# EAGLE design ab-berry-rev2 (EAGLE 7.3.0)
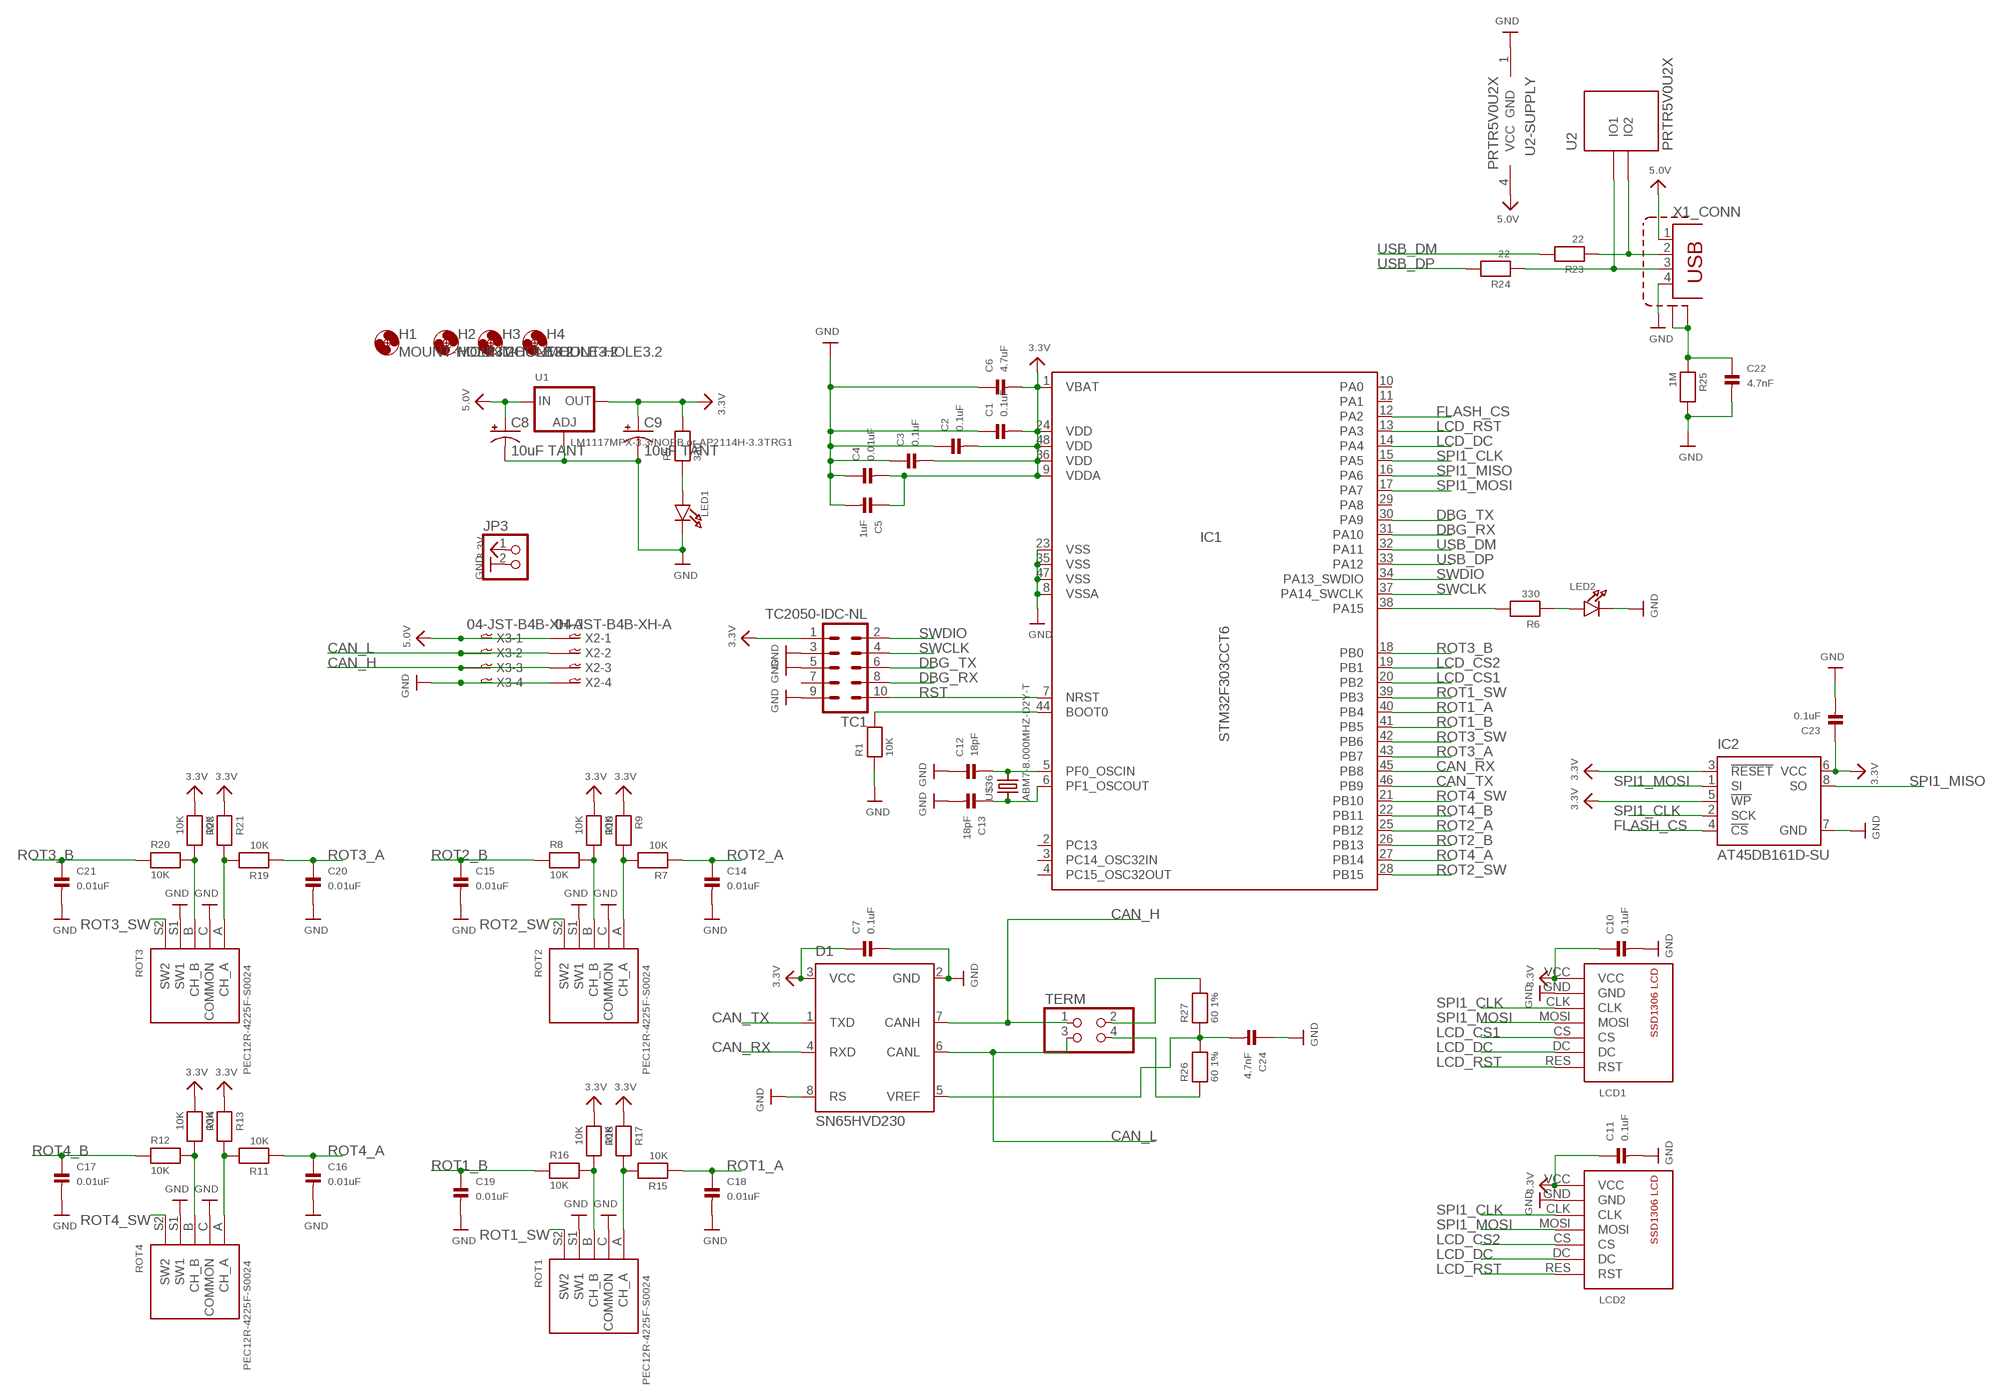
[diagram p0: schematic, sheet 1]

## Parts
C1  0.1uF  CAP_CERAMIC0603  [0603]
C2  0.1uF  CAP_CERAMIC0603  [0603]
C3  0.1uF  CAP_CERAMIC0603  [0603]
C4  0.01uF  CAP_CERAMIC0603  [0603]
C5  1uF  CAP_CERAMIC0603  [0603]
C6  4.7uF  CAP_CERAMIC0603  [0603]
C7  0.1uF  CAP_CERAMIC0603  [0603]
C8  10uF TANT  10UF-6.3V-20%(0603)(TANT)"  [0603-POL]
C9  10uF TANT  10UF-6.3V-20%(0603)(TANT)"  [0603-POL]
C10  0.1uF  CAP_CERAMIC0603  [0603]
C11  0.1uF  CAP_CERAMIC0603  [0603]
C12  18pF  CAP_CERAMIC0603  [0603]
C13  18pF  CAP_CERAMIC0603  [0603]
C14  0.01uF  CAP_CERAMIC0603  [0603]
C15  0.01uF  CAP_CERAMIC0603  [0603]
C16  0.01uF  CAP_CERAMIC0603  [0603]
C17  0.01uF  CAP_CERAMIC0603  [0603]
C18  0.01uF  CAP_CERAMIC0603  [0603]
C19  0.01uF  CAP_CERAMIC0603  [0603]
C20  0.01uF  CAP_CERAMIC0603  [0603]
C21  0.01uF  CAP_CERAMIC0603  [0603]
C22  4.7nF  CAP_CERAMIC0603  [0603]
C23  0.1uF  CAP_CERAMIC0603  [0603]
C24  4.7nF  CAP_CERAMIC0603  [0603]
D1  SN65HVD230  [SO8]
H1  MOUNT-HOLE3.2  [3,2]
H2  MOUNT-HOLE3.2  [3,2]
H3  MOUNT-HOLE3.2  [3,2]
H4  MOUNT-HOLE3.2  [3,2]
IC1  STM32F303CCT6  STM32F302_F303_B_C_LQFP48  [TQFP48]
IC2  AT45DB161D-SU  [8S2]
JP3  PINHD-1X2  [1X02]
LCD1  SSD1306-7PINWITHOUT-HOLES  [SSD1306-7PIN-NO-HOLES]
LCD2  SSD1306-7PINWITHOUT-HOLES  [SSD1306-7PIN-NO-HOLES]
LED1  LED0603  [CHIPLED_0603]
LED2  LED0603  [CHIPLED_0603]
R1  10K  RESISTOR0603  [0603]
R5  330  RESISTOR0603  [0603]
R6  330  RESISTOR0603  [0603]
R7  10K  RESISTOR0603  [0603]
R8  10K  RESISTOR0603  [0603]
R9  10K  RESISTOR0603  [0603]
R10  10K  RESISTOR0603  [0603]
R11  10K  RESISTOR0603  [0603]
R12  10K  RESISTOR0603  [0603]
R13  10K  RESISTOR0603  [0603]
R14  10K  RESISTOR0603  [0603]
R15  10K  RESISTOR0603  [0603]
R16  10K  RESISTOR0603  [0603]
R17  10K  RESISTOR0603  [0603]
R18  10K  RESISTOR0603  [0603]
R19  10K  RESISTOR0603  [0603]
R20  10K  RESISTOR0603  [0603]
R21  10K  RESISTOR0603  [0603]
R22  10K  RESISTOR0603  [0603]
R23  22  RESISTOR0603  [0603]
R24  22  RESISTOR0603  [0603]
R25  1M  RESISTOR0603  [0603]
R26  60 1%  RESISTOR0603  [0603]
R27  60 1%  RESISTOR0603  [0603]
ROT1  PEC12R-4225F-S0024  PEC11-4215K-S0024  [PEC111-4XXXK-SXXXX]
ROT2  PEC12R-4225F-S0024  PEC11-4215K-S0024  [PEC111-4XXXK-SXXXX]
ROT3  PEC12R-4225F-S0024  PEC11-4215K-S0024  [PEC111-4XXXK-SXXXX]
ROT4  PEC12R-4225F-S0024  PEC11-4215K-S0024  [PEC111-4XXXK-SXXXX]
TC1  TC2050-IDC-NL  [TC2050-IDC-NL]
TERM  PINHD-2X2  [2X02]
U1  LM1117MPX-3.3/NOPB or AP2114H-3.3TRG1  LM1117SOT223-REFLOW  [SOT223-R]
U2  PRTR5V0U2X  [SOT-143B]
U$36  ABM7-8.000MHZ-D2Y-T  [ABM7-8.000MHZ-D2Y-T]
X1  TE-292304-1  [TE-292304-1]
X2  04-JST-B4B-XH-A  [B4B-XH]
X3  04-JST-B4B-XH-A  [B4B-XH]

## Nets
3.3V: C1.2 C2.2 C3.2 C4.2 C5.1 C6.2 C7.1 C9.A(+) C10.1 C11.1 C23.1 D1.3(VCC) IC1.1(VBAT) IC1.9(VDDA) IC1.24(VDD) IC1.36(VDD) IC1.48(VDD) IC2.3(!RESET) IC2.5(!WP) IC2.6(VCC) JP3.1 LCD1.VCC LCD2.VCC R5.2 R9.1 R10.1 R13.1 R14.1 R17.1 R18.1 R21.1 R22.1 TC1.1 U1.2(OUT)
5.0V: C8.A(+) U1.3(IN) U2.4(VCC) X1.1 X2.P$1 X3.P$1
CAN_H: D1.7(CANH) TERM.1 X2.P$3 X3.P$3
CAN_L: D1.6(CANL) TERM.3 X2.P$2 X3.P$2
CAN_RX: D1.4(RXD) IC1.45(PB8)
CAN_TX: D1.1(TXD) IC1.46(PB9)
DBG_RX: IC1.31(PA10) TC1.8
DBG_TX: IC1.30(PA9) TC1.6
FLASH_CS: IC1.12(PA2) IC2.4(!CS)
GND: C1.1 C2.1 C3.1 C4.1 C5.2 C6.1 C7.2 C8.K(-) C9.K(-) C10.2 C11.2 C12.1 C13.2 C14.2 C15.2 C16.2 C17.2 C18.2 C19.2 C20.2 C21.2 C22.2 C23.2 C24.1 D1.2(GND) D1.8(RS) IC1.8(VSSA) IC1.23(VSS) IC1.35(VSS) IC1.47(VSS) IC2.7(GND) JP3.2 LCD1.GND LCD2.GND LED1.C LED2.C R1.1 R25.2 ROT1.C(COMMON) ROT1.S1(SW1) ROT2.C(COMMON) ROT2.S1(SW1) ROT3.C(COMMON) ROT3.S1(SW1) ROT4.C(COMMON) ROT4.S1(SW1) TC1.3 TC1.5 TC1.9 U1.1(ADJ) U2.1(GND) X1.4 X2.P$4 X3.P$4
LCD_CS1: IC1.20(PB2) LCD1.CS
LCD_CS2: IC1.19(PB1) LCD2.CS
LCD_DC: IC1.14(PA4) LCD1.DC LCD2.DC
LCD_RST: IC1.13(PA3) LCD1.RES(RST) LCD2.RES(RST)
N$1: IC1.44(BOOT0) R1.2
N$2: C24.2 D1.5(VREF) R26.2 R27.1
N$3: LED1.A R5.1
N$4: R27.2 TERM.2
N$5: R26.1 TERM.4
N$6: IC1.38(PA15) R6.2
N$7: LED2.A R6.1
N$8: C12.2 IC1.5(PF0_OSCIN) U$36.P$2
N$9: C13.1 IC1.6(PF1_OSCOUT) U$36.P$1
N$10: R8.2 R10.2 ROT2.B(CH_B)
N$11: R7.2 R9.2 ROT2.A(CH_A)
N$12: R12.2 R14.2 ROT4.B(CH_B)
N$13: R11.2 R13.2 ROT4.A(CH_A)
N$14: R16.2 R18.2 ROT1.B(CH_B)
N$15: R15.2 R17.2 ROT1.A(CH_A)
N$16: R20.2 R22.2 ROT3.B(CH_B)
N$17: R19.2 R21.2 ROT3.A(CH_A)
N$18: R23.1 U2.3(IO2) X1.2
N$19: R24.1 U2.2(IO1) X1.3
N$20: C22.1 R25.1 X1.P$1(SHIELD:S1) X1.P$2(SHIELD:S2)
ROT1_A: C18.1 IC1.40(PB4) R15.1
ROT1_B: C19.1 IC1.41(PB5) R16.1
ROT1_SW: IC1.39(PB3) ROT1.S2(SW2)
ROT2_A: C14.1 IC1.25(PB12) R7.1
ROT2_B: C15.1 IC1.26(PB13) R8.1
ROT2_SW: IC1.28(PB15) ROT2.S2(SW2)
ROT3_A: C20.1 IC1.43(PB7) R19.1
ROT3_B: C21.1 IC1.18(PB0) R20.1
ROT3_SW: IC1.42(PB6) ROT3.S2(SW2)
ROT4_A: C16.1 IC1.27(PB14) R11.1
ROT4_B: C17.1 IC1.22(PB11) R12.1
ROT4_SW: IC1.21(PB10) ROT4.S2(SW2)
RST: IC1.7(NRST) TC1.10
SPI1_CLK: IC1.15(PA5) IC2.2(SCK) LCD1.CLK LCD2.CLK
SPI1_MISO: IC1.16(PA6) IC2.8(SO)
SPI1_MOSI: IC1.17(PA7) IC2.1(SI) LCD1.MOSI LCD2.MOSI
SWCLK: IC1.37(PA14_SWCLK) TC1.4
SWDIO: IC1.34(PA13_SWDIO) TC1.2
USB_DM: IC1.32(PA11) R23.2
USB_DP: IC1.33(PA12) R24.2
Unconnected: IC1.2(PC13) IC1.3(PC14_OSC32IN) IC1.4(PC15_OSC32OUT) IC1.10(PA0) IC1.11(PA1) IC1.29(PA8) TC1.7

## Library data of the parts
C1-C7 C10-C24 = microbuilder:CAP_CERAMIC: Ceramic Capacitors 0402 - 0402 Surface Mount Capacitors 16pF 50V 5% [Digikey: 445-4899-2-ND] 18pF 50V 5% [Digikey: 490-1281-2-ND] 22pF 50V 5% [Digikey: 490-1283-2-ND] 68pF 50V 5% [Digikey: 490-1289-2-ND] 0.1uF 10V 10% [Digikey: 490-1318-2-ND] 1.0uF 6.3V 10% [Digikey: 490-1320-2-ND] 0603 - 0603 Surface Mount Capacitors 16 pF 50V 5% [Digikey: 445-5051-2-ND] 22 pF 50V [Digikey: PCC220ACVTR-ND] 33 pF 50V 5% [Digikey: 490-1415-1-ND] 56pF 50V 5% [Digikey: 490-1421-1-ND] 220pF 50V 5% [Digikey: 445-1285-1-ND] 680 pF 50V 2200 pF 50V 5% C0G [Digikey: 445-1297-1-ND] 5600 pF 100V 5% X7R [Digikey: 478-3711-1-ND] 0.1 µF 25V 10% [Digikey: PCC2277TR-ND] 0.22 µF 16V 10% X7R [Digikey: 445-1318-1-ND] 1.0 µF 25V 10% [Digikey: 445-5146-2-ND] 0603 - RF Specific 3pF 250V +/-0.1pF RF [Digikey: 712-1347-1-ND] 18 pF 250V 5% [Digikey: 478-3505-1-ND or 712-1322-1-ND] 56 pF 250V 5% C0G RF [Digikey: 490-4867-1-ND] 68 pF 250V RF [Digikey: 490-4868-1-ND] 0805 - 0805 Surface Mount Capacitors 220 pF 250V 2% RF Ceramic Capacitor [Digikey: 712-1398-1-ND] 1000 pF 50V 2% NP0 Ceramic Capacitor [Digikey: 478-3760-1-ND] 0.1 µF 25V 10% Ceramic Capacitor [Digikey: PCC1828TR-ND] 1.0 µF 16V 10% Ceramic Capacitor[Digikey: 490-1691-2-ND] 10.0 µF 10V 10% Ceramic Capacitor[Digikey: 709-1228-1-ND] 10.0 uF 16V 10% Ceramic Capacitor [Digikey: 478-5165-2-ND] 47 uF 6.3V 20% Ceramic Capacitor [Digikey: 587-1779-1-ND or 399-5506-1-ND] 1206 - 1206 Surface Mount Capacitors 47uF 10V 20% Ceramic Capacitor [Digikey: 490-5528-1-ND or 399-5508-1-ND or 445-6010-1-ND] 100uF 6.3V -20%, +80% Y5V Ceramic Capacitor (Digikey: 490-4512-1-ND, Mouser: 81-GRM31CF50J107ZE1L)
C8 C9 = SparkFun-Capacitors:10UF-6.3V-20%(0603)(TANT); PROD_ID: CAP-13210; VALUE: 10uF
D1 = omc:SN65HVD230: SN65HVD230 - 3.3V CAN Transceiver - 3.3V operation - ISO 11898 compliant - up to 1Mbps - up to 120 nodes - listen only mode - slope control
H1-H4 = holes:MOUNT-HOLE: MOUNTING HOLE with drill center marker
IC1 = keves:STM32F302_F303_B_C_LQFP48: STM32F302_F303_B_C_LQFP48 edit this description Auto generated by make-symbol-device-package-bsdl.ulp Rev. 44 Source: STM32F302_F303_B_C_LQFP48.bsd
IC2 = atmel:AT45DB161D: 16-megabit 2.5V or 2.7V DataFlash Source: http://www.atmel.com/dyn/resources/prod_documents/doc3500.pdf; MF: ATMEL; MPN: AT45DB161D-SU; OC_FARNELL: 1455040
JP3 = pinhead:PINHD-1X2: PIN HEADER
LCD1 LCD2 = keves:SSD1306-7PIN: https://www.aliexpress.com/item/free-shipping-0-96-inch-OLED-display-module-128X64-OLED-For-arduino-I2C-IIC-SPI-7p/32595065668.html?ws_ab_test=searchweb0_0,searchweb201602_1_116_117_10065_10068_114_10067_115_10069_113_10017_10080_10082_10081_10060_10061_10062_10056_10055_10054_10059_10078_10079_10073_10070_10052_10053_10050_10051,searchweb201603_6&btsid=51ed1bae-6cee-4f36-9ddd-1a85c2e0ff68
LED1 LED2 = microbuilder:LED: LED 0603 - 0603 Surface Mount Package 2mA: Green LED - Low Power (3.9mcd, 2ma, 1.7Vf) - Digikey: 475-2709-2-ND Orange LED - Low Power (9.8mcd, 2ma, 1.8Vf) - Digikey: 475-1194-2-ND Red LED - Low Power (5mcd, 2ma, 1.8Vf) - Digikey: 475-1195-2-ND Yellow LED - Low Power (7mcd, 2ma, 1.8Vf) - Digikey: 475-1196-2-ND 5mA: Blue LED - Low Power (17mcd, 5ma, 2.9Vf) - Digikey: LNJ937W8CRACT-ND 0805 - 0805 Surface Mount Package 2mA: Red LED (8.8mcd, 2mA, 1.8Vf, Clear) - Low Power [Digikey: 475-2510-1-ND] Green LED (5mcd, 2mA, 1.8Vf, Clear) - Low Power [Digikey: 475-2730-1-ND] Yellow LED (11.3mcd, 2mA, 1.8Vf, Clear) - Low Power [Digikey: 475-2555-1-ND] 20mA: Red LED (104mcd, 20mA, Diffused) - LS R976 [Digikey: 475-1278-6-ND] Red LED (12mcd, 20mA, 2.0Vf, Clear) - APT2012EC [Digikey: 754-1128-1-ND] Green LED (15mcd, 20mA, 2.2Vf, Clear) - APT2012GC [Digikey: 754-1131-1-ND] Orange LED (160mcd, 20mA, 2.1Vf, Clear) - APT2012SECK [Digikey: 754-1130-1-ND] 1206 - 1206 Surface Mount Package Green LED (26mcd, 20mA, Diffused) - LG N971 [Digikey: 475-1407-6-ND] Red LED (15mcd, 20mA, Diffused) - LH N974 [Digikey: 475-1416-6-ND]
R1 R5-R27 = microbuilder:RESISTOR: Resistors 0402 - 0402 Surface Mount Package 22 Ohm 1% 1/16W [Digikey: 311-22.0LRTR-ND] 33 Ohm 5% 1/16W 1.0K 5% 1/16W 1.5K 5% 1/16W 2.0K 1% 1/16W 10.0K 1% 1/16W [Digikey: 311-10.0KLRTR-ND] 10.0K 5% 1/16W [Digikey: RMCF0402JT10K0TR-ND] 12.1K 1% 1/16W [Digikey: 311-22.0LRTR-ND] 100.0K 5% 1/16W 0603 - 0603 Surface Mount Package 0 Ohm 1/10 Watt 1% Resistor 15 Ohm 1/10 Watt 1% Resistor 33 Ohm 1/10 Watt 1% Resistor 49.9 Ohm 1/10 Watt 1% Resistor 100 Ohm 1/10 Watt 1% Resistor 150 Ohm 1/10 Watt 1% Resistor 240 Ohm 1/10 Watt 1% Resistor 390 Ohm 1/10 Watt 1% Resistor 560 Ohm 1/10 Watt 1% Resistor 680 Ohm 1/10 Watt 1% Resistor 750 Ohm 1/10 Watt 1% Resistor 1.0K Ohm 1/10 Watt 1% Resistor 1.5K Ohm 1/10 Watt 1% Resistor 2.0K Ohm 1/10 Watt 1% Resistor 2.2K Ohm 1/10 Watt 1% Resistor 3.3K Ohm 1/10 Watt 1% Resistor 4.7K Ohm 1/10 Watt 1% Resistor 10.0K Ohm 1/10 Watt 1% Resistor 12.0K Ohm 1/10 Watt 1% Resistor 12.1K Ohm 1/10 Watt 1% Resistor 20.0K Ohm 1/10 Watt 1% Resistor 33.0K Ohm 1/10 Watt 1% Resistor 100.0K Ohm 1/10 Watt 1% Resistor 0805 - 0805 Surface Mount Package 0 Ohm 1/8 Watt 1% Resistor 33 Ohm 1/8 Watt 1% Resistor 100 Ohm 1/8 Watt 1% Resistor 150 Ohm 1/8 Watt 1% Resistor 200 Ohm 1/8 Watt 1% Resistor 240 Ohm 1/8 Watt 1% Resistor 330 Ohm 1/8 Watt 1% Resistor 390 Ohm 1/8 Watt 1% Resistor 470 Ohm 1/8 Watt 1% Resistor 1.0K Ohm 1/8 Watt 1% Resistor 1.5K Ohm 1/8 Watt 1% Resistor 2.0K Ohm 1/8 Watt 1% Resistor 4.7K Ohm 1/8 Watt 1% Resistor 5.1K Ohm 1/8 Watt 1% Resistor 5.6K Ohm 1/8 Watt 1% Resistor 10.0K Ohm 1/8 Watt 1% Resistor 22.0K Ohm 1/8 Watt 1% Resistor 33.0K Ohm 1/8 Watt 1% Resistor 100K Ohm 1/8 Watt 1% Resistor 1206 - 1206 Surface Mount Package 2012 - 2010 Surface Mount Package 0.11 Ohm 1/2 Watt 1% Resistor - Digikey: RHM.11UCT-ND
ROT1-ROT4 = keves:PEC11-4215K-S0024
TC1 = TagConnect:TC2050-IDC: Tag-Connect In Circuit Programming & Debug Cable 10 Pin http://www.tag-connect.com
TERM = pinhead:PINHD-2X2: PIN HEADER
U1 = microbuilder:LM1117: LM1117 Voltage Regulator LM1117 Adjustable Voltage regulator [Digikey: LM1117IMP-ADJDKR-ND] LM1117 3.3V Voltage regulator [AP1117E33GDIDKR-ND] LM1117 5.0V Voltage regulator [AP1117E50GDIDKR-ND] SOT223-REFLOW - SOT223 package for solder paste/reflow ovens SOT223-WAVE - SOT223 package for hand-soldering (larger pads) Note: For the fixed-voltage regulators, simply set the ADJ pin to GND.
U2 = Volks73-NXPSemiconductors:PRTR5V0U2X?: I2C-Bus EDS Protection Ulta low capacitance double rail-to-rail ESD protection diode Documentation Datasheet <http://www.nxp.com/documents/data_sheet/PRTR5V0U2X.pdf> General Description Ultra low capacitance rail-to-rail ElectroStatic Discharge (ESD) protection diode in a small SOT143B Surface-Mounted Device (SMD) plastic package designed to protect two Hi-Speed data lines or high-frequency signal lines from the damage caused by ESD and other transients. PRTR5V0U2X incorporates two pairs of ultra low capacitance rail-to-rail diodes as well as an additional ESD protection diode to ensure signal line protection even if no supply voltage is available. Features ESD protection of two Hi-Speed data lines or high-frequency signal lines Ultra low input/output to ground capacitance: C(I/O-GND) = 1 pF ESD protection up to 8kV IEC 61000-4-2, level 4 (ESD) Very low clamping voltage due to an integrated additional ESD protection diode Very low reverse current Small SMD plastic package Applications USB 2.0 ports Digital Video Interface (DVI)/High Definition Multimedia Interface (HDMI) interfaces Mobile and cordless phones Personal Digital Assistants (PDA) Digital Cameras Wide Area Network (WAN) / Local Area Network (LAN) systems PCs, notebooks, printers, and other PC peripherals; APPLICATIONS: General Purpose; BIDIRECTIONAL_CHANNELS: 2; CAPACITANCE: 1pF @ 1MHz; CURRENT_PEAK_PULSE: -; DESCRIPTION: TVS DIODE 5.5VWM SOT143B; DOCUMENTATION_LINK: <a href="http://www.nxp.com/documents/data_sheet/PRTR5V0U2X.pdf">Datasheet</a>; DOCUMENTATION_URL: http://www.nxp.com/documents/data_sheet/PRTR5V0U2X.pdf; MANUFACTURER: NXP Semiconductors; MOUNTING_TYPE: Surface Mount; OPERATING_TEMPERATURE: -40C ~ 85C; PART_NUMBER: PRTR5V0U2X,215; POWER-PEAK_PULSE: -; POWER_LINE_PROTECTION: Yes; SUPPLIER_ITEM_LINK: <a href="http://www.digikey.com/product-detail/en/PRTR5V0U2X,215/568-4140-1-ND/1589981">Details</a>; SUPPLIER_ITEM_NUMBER: 568-4140-1-ND; SUPPLIER_ITEM_URL: http://www.digikey.com/product-detail/en/PRTR5V0U2X,215/568-4140-1-ND/1589981; SUPPLIER_LINK: <a href="http://www.digikey.com">Home Page</a>; SUPPLIER_NAME: Digi-Key; SUPPLIER_URL: http://www.digikey.com; TYPE: Steering (Rail to Rail); UNIDIRECTIONAL_CHANNELS: -; VOLTAGE_BREAKDOWN: 6V; VOLTAGE_CLAMPING: -; VOLTAGE_REVERSE: 5.5V
U$36 = keves:ABM7-8.000MHZ-D2Y-T
X1 = keves:TE-292304-1: USB A Female connector
X2 X3 = bt_con-jst-xh:04-JST: JST CONNECTOR

## Board
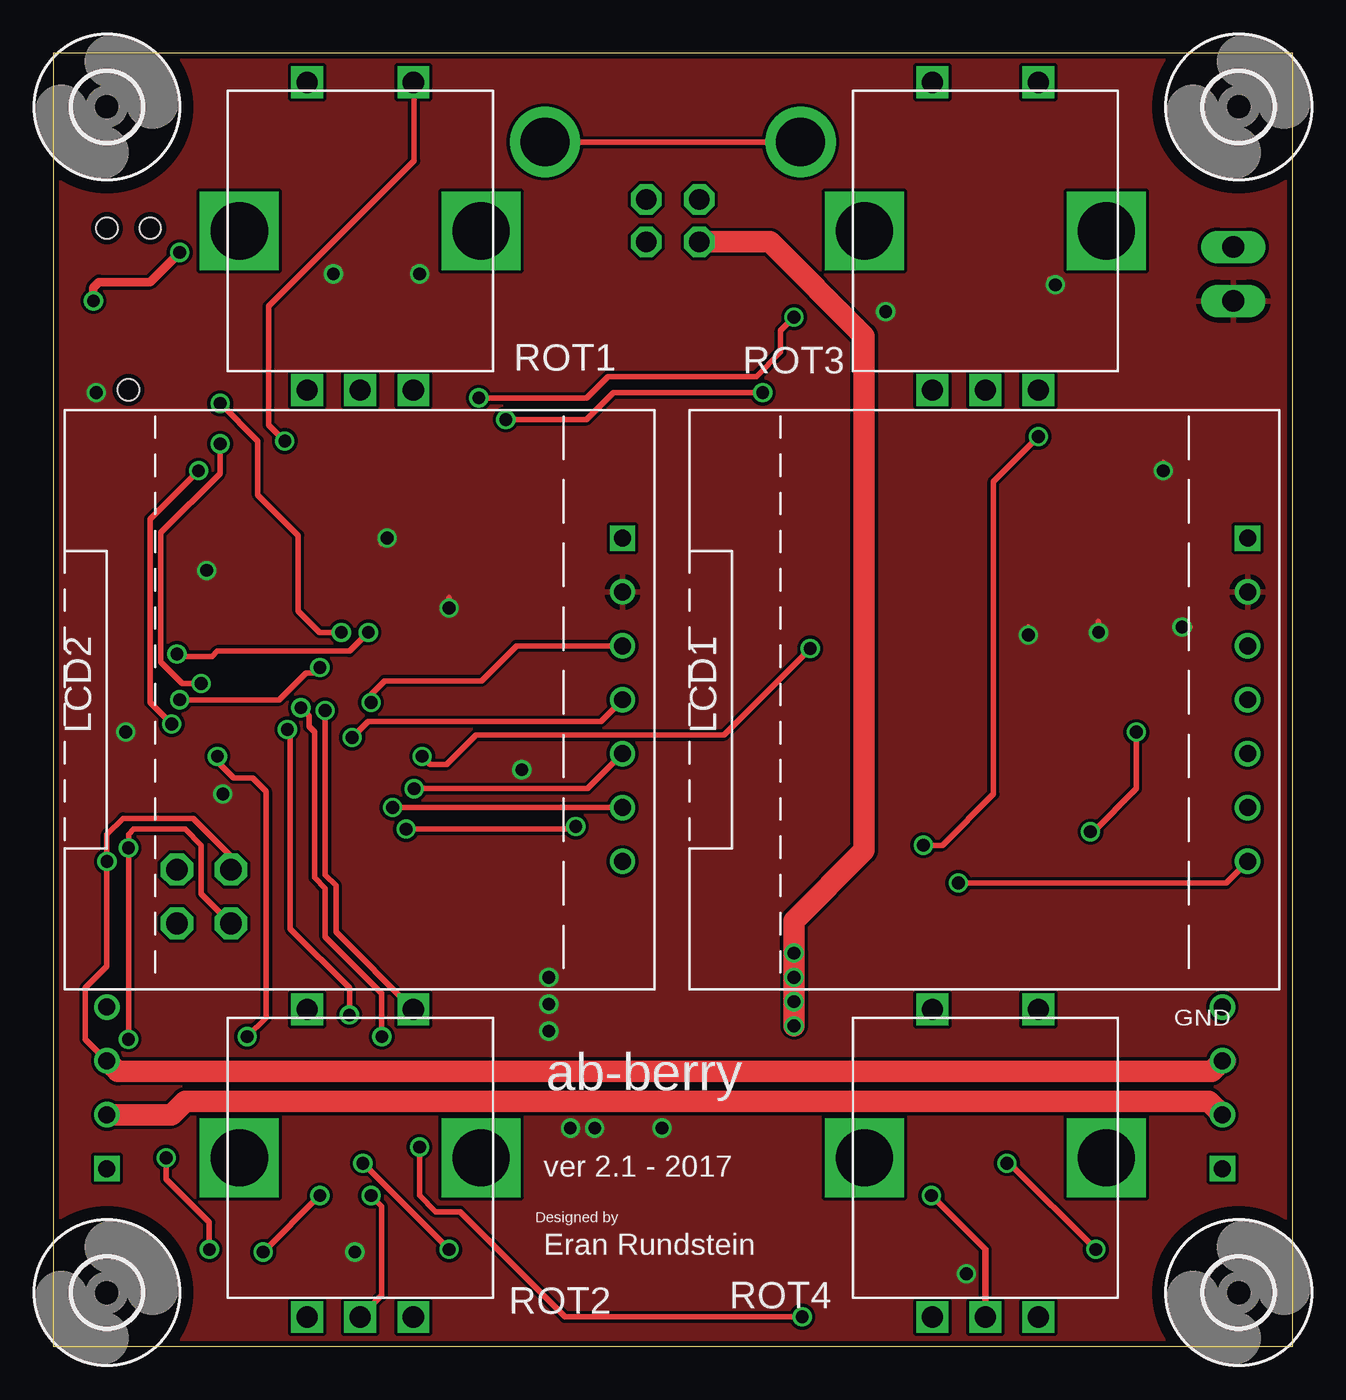
[diagram p1: board, top side]
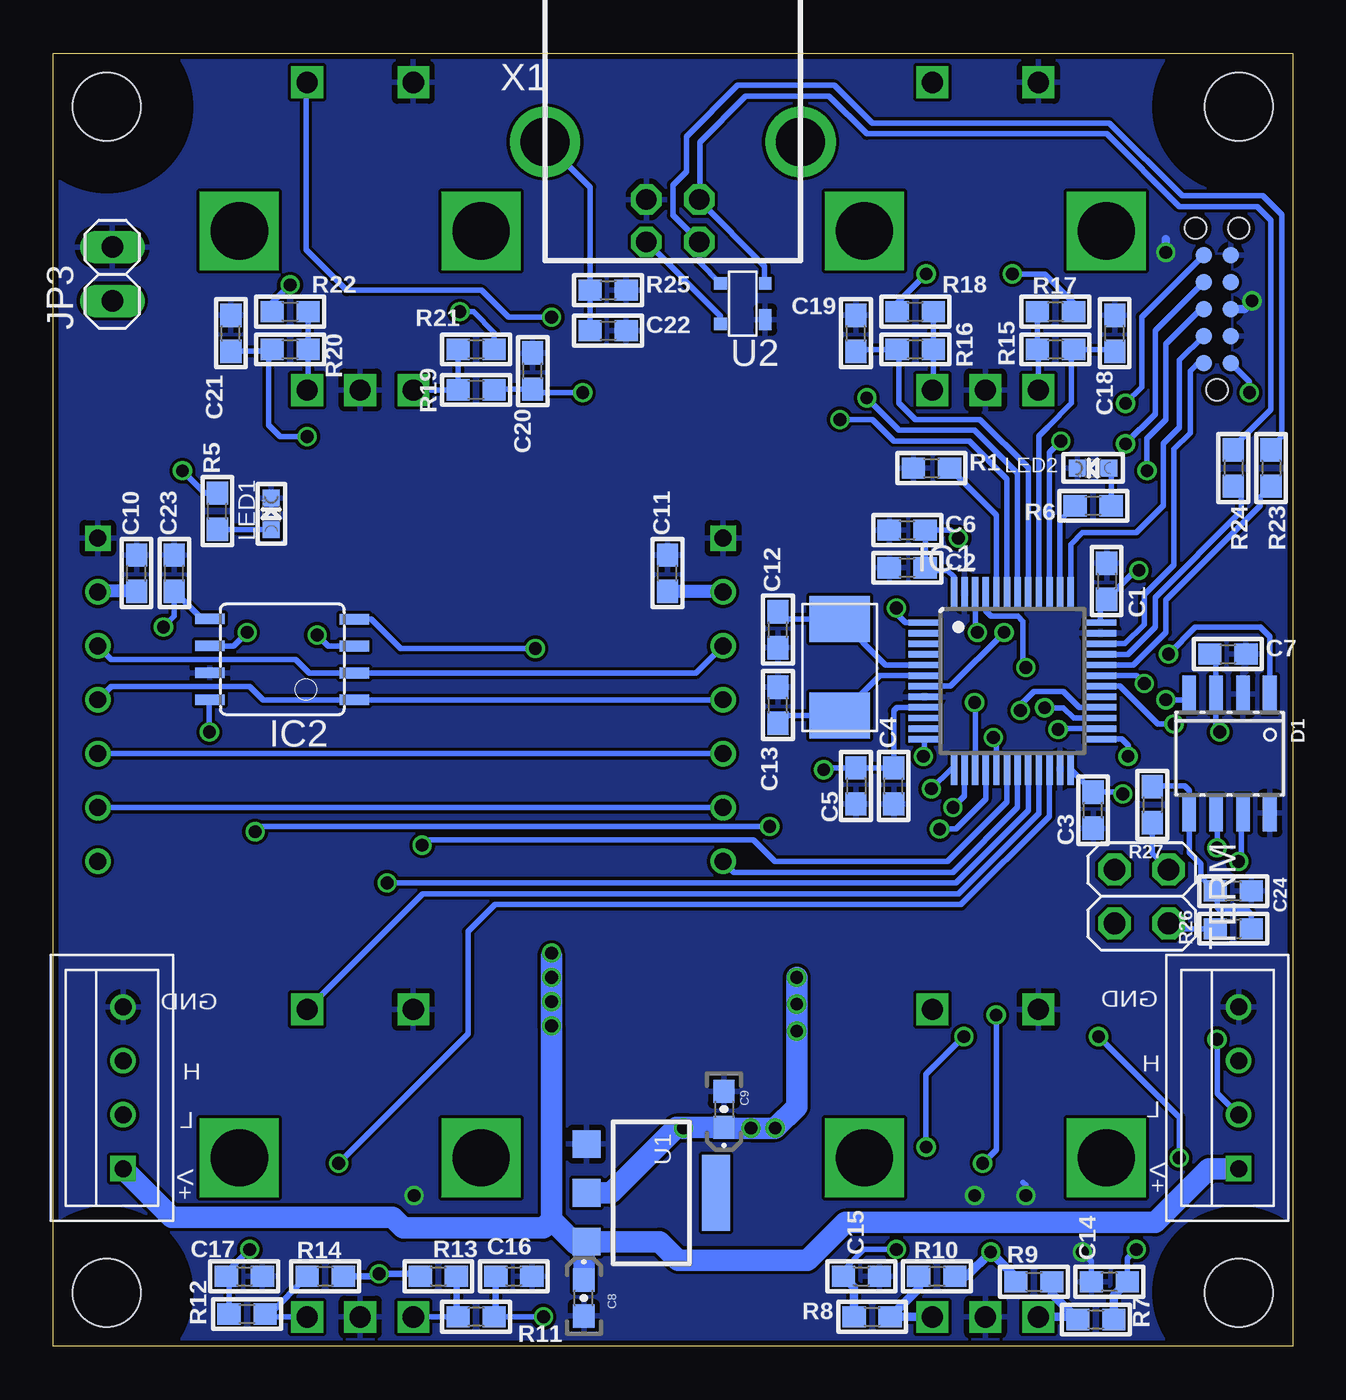
[diagram p2: board, bottom side, seen from below]

Size 58.42 x 60.96 mm. Coordinates in mm from the lower left corner, seen from the top.
Outline: 0,0 58.42,0 58.42,60.96 0,60.96 0,0
Copper layers (1*16): Top 0.035mm / dielectric 1.5mm / Bottom 0.035mm
Design rules "MacroFab_Standard_2_Layer *": minimum track width 6mil, minimum drill 12mil, track to track 6mil, track to pad 6mil, pad to pad 6mil, via to via 6mil, smd to smd 0mil, copper to edge 10mil, drill to drill 10mil, minimum pad ring 6mil, minimum via ring 6mil, stop-mask expansion 2mil, vias tented up to drill 25mil, thermal gap 10mil

### Footprints (pad centres in the part's own frame; a part is rotated, then mirrored left to right if it is on the bottom)
0603 = smd 1.1 x 1: 1 -0.85,0; 2 0.85,0
0603-POL = smd 1.1 x 1: A 0.85,0; K -0.85,0
SO8 = smd 0.65 x 1.75: 1 -1.905,-2.8; 2 -0.635,-2.8; 3 0.635,-2.8; 4 1.905,-2.8; 5 1.905,2.8; 6 0.635,2.8; 7 -0.635,2.8; 8 -1.905,2.8
3,2 = hole 3.2: 0,0
TQFP48 = smd 1.5 x 0.3: 1 -4.15,2.75; 2 -4.15,2.25; 3 -4.15,1.75; 4 -4.15,1.25; 5 -4.15,0.75; 6 -4.15,0.25; 7 -4.15,-0.25; 8 -4.15,-0.75; 9 -4.15,-1.25; 10 -4.15,-1.75; 11 -4.15,-2.25; 12 -4.15,-2.75; 25 4.15,-2.75; 26 4.15,-2.25; 27 4.15,-1.75; 28 4.15,-1.25; 29 4.15,-0.75; 30 4.15,-0.25; 31 4.15,0.25; 32 4.15,0.75; 33 4.15,1.25; 34 4.15,1.75; 35 4.15,2.25; 36 4.15,2.75 | smd 0.3 x 1.5: 13 -2.75,-4.15; 14 -2.25,-4.15; 15 -1.75,-4.15; 16 -1.25,-4.15; 17 -0.75,-4.15; 18 -0.25,-4.15; 19 0.25,-4.15; 20 0.75,-4.15; 21 1.25,-4.15; 22 1.75,-4.15; 23 2.25,-4.15; 24 2.75,-4.15; 37 2.75,4.15; 38 2.25,4.15; 39 1.75,4.15; 40 1.25,4.15; 41 0.75,4.15; 42 0.25,4.15; 43 -0.25,4.15; 44 -0.75,4.15; 45 -1.25,4.15; 46 -1.75,4.15; 47 -2.25,4.15; 48 -2.75,4.15
8S2 = smd 0.5 x 1.4: 1 -1.905,-3.404; 2 -0.645,-3.404; 3 0.625,-3.404; 4 1.895,-3.404; 5 1.905,3.404; 6 0.635,3.404; 7 -0.635,3.404; 8 -1.905,3.404
1X02 = drill 1.016 long: 1 -1.27,0; 2 1.27,0
SSD1306-7PIN-NO-HOLES = drill 0.8: CLK -2.54,24.3; CS 7.62,24.3; DC 5.08,24.3; MOSI 0,24.3; RES 2.54,24.3; VCC -5.08,24.3 | drill 0.8 square: GND -7.62,24.3
CHIPLED_0603 = smd 0.8 x 0.8: A 0,-0.75; C 0,0.75
PEC111-4XXXK-SXXXX = drill 1 square: A -2.5,-7.5; B 2.5,-7.5; C 0,-7.5; S1 -2.5,7; S2 2.5,7 | drill 2.7 square: P$1 -5.7,0; P$2 5.7,0
TC2050-IDC-NL = smd 0.787 x 0.787: 1 -2.54,-0.635; 2 -2.54,0.635; 3 -1.27,-0.635; 4 -1.27,0.635; 5 0,-0.635; 6 0,0.635; 7 1.27,-0.635; 8 1.27,0.635; 9 2.54,-0.635; 10 2.54,0.635 | hole 0.991: -3.81,0; 3.81,1.016; 3.81,-1.016
2X02 = drill 1.016 octagon: 1 -1.27,-1.27; 2 -1.27,1.27; 3 1.27,-1.27; 4 1.27,1.27
SOT223-R = smd 1.3 x 1.3: 1 -2.3,-3.05; 2 0,-3.05; 3 2.3,-3.05 | smd 3.6 x 1.3: 4 0,3.05
SOT-143B = smd 1 x 0.6: 1 -0.75,-1.05 | smd 0.6 x 0.6: 2 0.95,-1.05; 3 0.95,1.05; 4 -0.95,1.05
ABM7-8.000MHZ-D2Y-T = smd 2.159 x 2.845: P$1 -2.273,0; P$2 2.273,0
TE-292304-1 = drill 0.95 octagon: 1 1.25,4.71; 2 -1.25,4.71; 3 -1.25,2.71; 4 1.25,2.71 | drill 2.3: P$1 6.02,0; P$2 -6.02,0
B4B-XH = drill 0.8 square: P$1 -3.81,0 | drill 0.8: P$2 -1.27,0; P$3 1.27,0; P$4 3.81,0

### Placement (x,y rotation side)
C1  8.76,36.07 270 bottom
C2  18.16,36.7 0 bottom
C3  9.4,25.27 90 bottom
C4  18.8,26.42 90 bottom
C5  20.57,26.42 270 bottom
C6  18.16,38.48 0 bottom
C7  3.05,32.64 0 bottom
C8  33.4,2.29 90 bottom
C9  26.8,11.18 270 bottom
C10  54.48,36.45 90 bottom
C11  29.46,36.45 90 bottom
C12  24.26,33.78 90 bottom
C13  24.26,30.23 90 bottom
C14  8.64,3.05 180 bottom
C15  20.32,3.3 0 bottom
C16  36.7,3.3 0 bottom
C17  49.4,3.3 0 bottom
C18  8.38,47.75 90 bottom
C19  20.57,47.75 90 bottom
C20  35.81,45.97 90 bottom
C21  50.04,47.75 90 bottom
C22  32.26,47.88 0 bottom
C23  52.7,36.45 90 bottom
C24  2.79,21.46 180 bottom
D1  2.97,27.94 180 bottom
H1  2.54,58.42 0 top
H2  2.54,2.54 0 top
H3  55.88,58.42 0 top
H4  55.88,2.54 0 top
IC1  13.21,31.37 0 bottom
IC2  47.62,32.38 90 bottom
JP3  55.63,50.55 90 bottom
LCD1  32,30.48 270 top
LCD2  2.54,30.48 270 top
LED1  48.13,39.24 0 bottom
LED2  9.4,41.4 90 bottom
R1  17.02,41.4 0 bottom
R5  50.67,39.37 90 bottom
R6  9.4,39.62 180 bottom
R7  9.27,1.27 180 bottom
R8  19.81,1.4 0 bottom
R9  12.19,3.05 0 bottom
R10  16.76,3.3 180 bottom
R11  38.48,1.4 180 bottom
R12  49.28,1.52 0 bottom
R13  40.26,3.3 0 bottom
R14  45.59,3.3 180 bottom
R15  11.18,46.99 180 bottom
R16  17.78,46.99 0 bottom
R17  11.18,48.77 180 bottom
R18  17.78,48.77 0 bottom
R19  38.48,45.09 180 bottom
R20  47.24,46.99 0 bottom
R21  38.48,46.99 180 bottom
R22  47.24,48.77 0 bottom
R23  1.02,41.4 270 bottom
R24  2.79,41.4 270 bottom
R25  32.26,49.78 0 bottom
R26  2.79,19.68 0 bottom
R27  6.6,25.53 270 bottom
ROT1  14.48,52.58 0 top
ROT2  14.48,8.89 0 top
ROT3  43.94,52.58 0 top
ROT4  43.94,8.89 0 top
TC1  3.56,48.9 90 bottom
TERM  7.11,21.21 270 bottom
U1  30.23,7.24 270 bottom
U2  25.91,49.15 90 bottom
U$36  21.34,32 90 bottom
X1  29.21,56.77 180 bottom
X2  55.12,12.19 90 bottom
X3  2.54,12.19 90 bottom

### Tracks (layer width: path | path; a pad name or v marks a point on that pad's centre or on a via)
3.3V  (via drill 0.6)
  Top 0.254: v22.1,27.18 22.35,26.92 | v15.75,38.1 15.49,37.85 | v17.27,50.55 17.02,50.8 | v13.21,50.55 13.46,50.8 | v47.24,50.04 46.99,50.29 | v18.67,34.8 18.67,35.31 | v52.32,41.27 52.32,41.66 | v39.24,48.77 39.5,48.77 | v53.21,33.91 53.59,33.91 | v49.28,33.66 49.28,34.16 | v45.97,33.53 45.97,33.91 | v3.43,28.96 3.3,28.83
  Top 0.406: v14.22,4.45 14.35,4.57
  Bottom 0.254: v22.1,27.18 22.01,27.27 C5.1 C4.2 18.8,29.97 18.65,30.12 IC1.9 | v15.75,38.1 16.13,38.48 C6.2 C2.2 17.18,36.58 16.26,36.58 15.96,36.28 IC1.48 | 8.68,35.31 C1.2 | R14.1 44.74,3.52 | R18.1 18.63,49.19 v17.27,50.55 | R17.1 10.33,49.19 11.68,50.55 v13.21,50.55 | R22.1 48.09,49.19 v47.24,50.04 | IC1.1 18.24,34.12 18.67,34.54 v18.67,34.8 | IC1.36 9.06,34.92 C1.2 | v7.24,36.58 7.41,36.58 C1.2 | R5.2 51.27,40.22 v52.32,41.27 | R21.1 37.63,47.79 38.61,48.77 v39.24,48.77 | v53.21,33.91 52.7,34.42 C23.1 51.4,34.29 IC2.5 | IC2.6 49.91,33.02 v49.28,33.66 | IC2.3 45.46,33.01 v45.97,33.53 | v2.03,44.96 2.03,45.47 TC1.1 | C7.1 3.61,32.35 D1.3 3.61,29.13 v3.43,28.96 | IC1.24 10.46,27.18 C3.2 8.09,26.12 v8,26.04
  Bottom 0.305: R13.1 41.24,3.43 v43.05,3.43 43.18,3.3 R14.1
  Bottom 0.406: R9.1 13.04,3.26 v14.22,4.45 15.37,3.3 R10.1
  Bottom 0.61: C11.1 26.8,35.6 LCD2.VCC | C10.1 56.27,35.6 LCD1.VCC
  Bottom 1.016: 28.45,10.33 29.04,10.33 32.13,7.24 U1.2 | v28.7,10.29 28.49,10.29 28.45,10.33 | v25.53,10.29 v24.38,10.29 | 28.45,10.33 C9.A 26.8,10.29 v24.38,10.29 | v23.37,17.4 v23.37,14.86 23.37,11.3 v24.38,10.29
  other vias: 23.37,16.13
  pour Top: -1.78,-3.94 67.94,-3.94 67.94,66.17 -4.95,66.17 -4.95,64.26 -1.91,64.26 -1.91,-3.81
5.0V  (via drill 0.6)
  Top 1.016: v34.92,15.11 v34.92,16.26 v34.92,17.4 v34.92,18.54 34.92,20.07 38.23,23.37 38.23,47.62 33.79,52.06 X1.1
  Bottom 0.254: U2.4 26.96,48.56 X1.1
  Bottom 1.016: U1.3 29.83,4.94 28.96,4.06 22.86,4.06 21.08,5.84 6.48,5.84 3.94,8.38 X3.P$1 | U1.3 33.39,4.83 33.78,4.83 34.92,5.97 | 34.92,18.41 v34.92,17.4 v34.92,16.26 v34.92,15.11 34.92,5.97 | C8.A 33.4,4.81 U1.3 | 34.92,5.97 35.31,5.59 41.91,5.59 42.42,6.1 52.83,6.1 X2.P$1
CAN_H  (via drill 0.6)
  Top 0.254: X3.P$3 1.52,14.48 1.52,16.89 2.54,17.91 v2.54,22.86 2.54,24.13 3.3,24.89 6.6,24.89 8.38,23.11 TERM.1
  Top 1.016: 55.24,13.46 X2.P$3 54.61,12.95 3.05,12.95 X3.P$3
  Bottom 0.254: D1.7 2.41,25.06 2.41,22.99 v2.54,22.86
CAN_L  (via drill 0.6)
  Top 0.254: v3.56,14.48 v3.56,23.5 3.56,24.13 3.81,24.38 6.22,24.38 6.99,23.62 6.99,21.34 TERM.3
  Top 1.016: X3.P$2 5.59,10.92 6.22,11.56 54.48,11.56 X2.P$2
  Bottom 0.254: v3.56,23.5 3.56,25.09 D1.6 | v3.56,14.48 3.56,11.94 X3.P$2
CAN_RX  (via drill 0.6)
  Top 0.254: v5.97,30.48 10.67,30.48 11.94,31.75 12.32,31.75 v12.57,32
  Bottom 0.254: IC1.45 14.46,34.65 14.22,34.42 12.95,34.42 12.7,34.16 12.7,32.13 v12.57,32 | v5.97,30.48 5.14,30.48 D1.4
CAN_TX  (via drill 0.6)
  Top 0.254: v14.86,33.66 13.97,32.77 7.75,32.77 7.49,32.51 5.97,32.51 v5.84,32.64
  Bottom 0.254: IC1.46 14.96,33.75 v14.86,33.66 | D1.1 1.07,33.45 1.52,33.91 4.57,33.91 v5.84,32.64
DBG_RX  (via drill 0.6)
  Top 0.254: v6.99,31.24 6.1,31.24 5.08,32.26 5.08,38.35 7.87,41.15 v7.87,42.55
  Bottom 0.254: v7.87,42.55 6.48,43.94 6.48,47.88 TC1.8 | IC1.31 7.36,31.62 v6.99,31.24
DBG_TX  (via drill 0.6)
  Top 0.254: v6.86,41.27 4.57,38.99 4.57,30.35 v5.59,29.34
  Bottom 0.254: v6.86,41.27 6.86,42.8 5.97,43.69 5.97,47.24 4.32,48.9 TC1.6 | IC1.30 8.13,31.12 6.35,29.34 v5.59,29.34
FLASH_CS  (via drill 0.6)
  Top 0.254: v17.4,27.81 17.78,27.43 18.54,27.43 19.94,28.83 31.62,28.83 v35.69,32.89
  Bottom 0.254: IC1.12 17.36,27.85 v17.4,27.81 | v35.69,32.89 42.04,32.89 43.43,34.29 IC2.4
GND  (via drill 0.6)
  Top 0.254: v14.99,7.11 15.49,6.6 15.49,2.41 ROT2.C | v9.91,4.45 v12.57,7.11
  Top 0.305: ROT4.C 43.94,4.57 v41.4,7.11
  Top 0.406: v1.91,49.28 1.91,49.91 2.16,50.16 4.57,50.16 v5.97,51.56
  Bottom 0.254: C14.2 9.49,4.03 v9.91,4.45 | v12.57,7.11 12.57,7.62 12.7,7.75
  Bottom 0.406: TC1.5 2.29,48.9 v1.91,49.28 | v5.97,51.56 5.97,52.2
  pour Bottom: -2.54,-2.92 67.18,-2.92 67.18,67.18 -5.71,67.18 -5.71,65.28 -2.67,65.28 -2.67,-2.79
LCD_CS1  (via drill 0.6)
  Top 0.254: v42.67,21.84 55.29,21.84 LCD1.CS
  Bottom 0.254: v42.67,21.84 15.88,21.84 12.46,25.26 IC1.20
LCD_CS2
  Bottom 0.254: LCD2.CS 26.33,22.35 16,22.35 12.96,25.4 IC1.19
LCD_DC  (via drill 0.6)
  Top 0.254: v16,25.4 LCD2.DC
  Bottom 0.254: LCD1.DC LCD2.DC | IC1.14 15.46,25.94 v16,25.4
LCD_RST  (via drill 0.6)
  Top 0.254: v17.02,26.29 25.19,26.29 LCD2.RES
  Bottom 0.254: LCD1.RES LCD2.RES | IC1.13 16.09,27.22 v17.02,26.29
N$1
  Bottom 0.254: R1.2 14.05,39.29 13.96,39.19 IC1.44
N$2
  Bottom 0.254: R26.2 1.94,20.36 2.16,20.57 3.43,20.57 3.56,20.7 3.56,21.38 C24.2 4.32,22.14 4.32,22.73 4.88,23.29 D1.5 4.88,26.21 5.08,26.42 6.57,26.42 R27.1
N$3
  Bottom 0.254: LED1.A 50.65,38.49 R5.1
N$4
  Bottom 0.254: R27.2 6.6,23.24 TERM.2
N$5
  Bottom 0.254: R26.1 5.59,19.68 TERM.4
N$6
  Bottom 0.254: IC1.38 10.96,38.91 R6.2
N$7
  Bottom 0.254: R6.1 8.55,41.3 LED2.A
N$8
  Bottom 0.254: C12.2 23.9,34.28 U$36.P$2 19.18,32.12 IC1.5
N$9
  Bottom 0.254: C13.1 23.9,29.73 U$36.P$1 19.45,31.62 IC1.6
N$10
  Bottom 0.406: ROT2.B R8.2 17.61,2.75 R10.2
N$11
  Bottom 0.406: ROT2.A 10.12,1.39 R7.2 11.34,2.49 R9.2
N$12
  Bottom 0.254: R14.2 48.22,1.52 | 48.22,1.52 R12.2 | 48.22,1.52 48.09,1.39 ROT4.B
N$13
  Bottom 0.254: ROT4.A R11.2
  Bottom 0.305: R13.2 39.41,1.48 R11.2
N$14
  Bottom 0.254: R18.2 R16.2 16.93,45.13 ROT1.B
N$15
  Bottom 0.254: ROT1.A 11.98,46.94 R15.2 R17.2
N$16
  Bottom 0.254: ROT3.B 46.39,45.13 R20.2 R22.2
N$17
  Bottom 0.254: R21.2 R19.2 ROT3.A
N$18
  Bottom 0.254: U2.3 27.96,51.1 X1.2 29.21,53.31 29.21,54.74 28.57,55.37 28.57,57.02 26.16,59.44 21.59,59.44 19.81,57.66 8.64,57.66 5.21,54.23 1.4,54.23 0.51,53.34 0.51,42.89 1.02,42.38 R23.1
N$19
  Bottom 0.254: U2.2 24.89,50.13 24.89,50.93 27.96,53.99 X1.3 27.94,54.08 27.94,56.77 25.78,58.93 21.84,58.93 20.07,57.15 8.76,57.15 5.33,53.72 1.65,53.72 1.02,53.09 1.02,44.16 2.79,42.38 R24.1
N$20
  Top 0.254: X1.P$2 X1.P$1
  Bottom 0.254: C22.1 R25.1 33.11,54.65 X1.P$1
ROT1_A
  Bottom 0.254: C18.1 8.47,46.99 R15.1 10.41,46.9 10.41,44.45 11.56,43.31 11.96,42.91 IC1.40
ROT1_B
  Bottom 0.254: C19.1 20.49,46.99 R16.1 18.54,46.9 18.54,44.45 17.78,43.69 14.73,43.69 12.46,41.41 IC1.41
ROT1_SW  (via drill 0.6)
  Top 0.254: v10.92,42.67 10.16,43.43 10.16,49.02 17.02,55.88 17.02,59.54 ROT1.S2
  Bottom 0.254: v10.92,42.67 11.46,42.14 IC1.39
ROT2_A  (via drill 0.6)
  Top 0.254: v7.37,4.57 7.37,5.84 5.33,7.87 v5.33,8.89 | v9.14,14.61 10.03,15.49 10.03,26.16 9.4,26.8 8.51,26.8 7.75,27.56 v7.75,27.81
  Bottom 0.254: C14.1 7.79,4.15 v7.37,4.57 | v5.33,8.89 5.33,10.79 v9.14,14.61 8.89,14.35 | IC1.25 8.04,28.62 7.75,28.32 v7.75,27.81
  Bottom 0.406: R7.1 8.42,2.41 C14.1
ROT2_B  (via drill 0.6)
  Top 0.254: v14.61,8.64 v18.67,4.57 | v13.97,15.62 13.97,16.89 11.18,19.68 11.18,28.96 v11.05,29.08
  Bottom 0.254: C15.1 21.17,3.6 20.19,4.57 v18.67,4.57 | v13.97,15.62 13.97,9.27 v14.61,8.64 | IC1.26 11.01,29.12 v11.05,29.08
  Bottom 0.406: R8.1 20.66,2.79 C15.1
ROT2_SW  (via drill 0.6)
  Top 0.254: ROT2.S2 13.34,19.53 13.34,21.72 12.83,22.23 v12.83,29.97
  Bottom 0.254: IC1.28 10.05,30.12 10.79,30.86 12.19,30.86 12.83,30.23 v12.83,29.97
ROT3_A  (via drill 0.6)
  Top 0.254: v21.34,43.69 25.15,43.69 26.42,44.96 v33.45,44.96
  Bottom 0.254: v21.34,43.69 19.81,43.69 18.8,42.67 15.24,42.67 13.46,40.89 IC1.43 | v33.45,44.96 35.65,44.96 C20.1 37.59,45.12 R19.1
ROT3_B  (via drill 0.6)
  Top 0.254: v46.44,42.89 44.32,40.77 44.32,26.04 41.91,23.62 v41.02,23.62
  Bottom 0.254: v46.44,42.89 47.71,42.89 48.26,43.43 48.26,46.82 R20.1 48.18,46.9 C21.1 | v41.02,23.62 40.77,23.88 25.4,23.88 24.38,22.86 17.65,22.86 17.02,22.86 16.26,22.86 13.46,25.66 IC1.18
ROT3_SW  (via drill 0.6)
  Top 0.254: v20.07,44.7 25.15,44.7 26.16,45.72 33.15,45.72 34.29,46.86 34.29,47.88 v34.92,48.51
  Bottom 0.254: v20.07,44.7 18.54,43.18 14.99,43.18 12.96,41.15 IC1.42 | v34.92,48.51 36.96,48.51 38.23,49.78 44.58,49.78 46.48,51.69 46.48,59.54 ROT3.S2
ROT4_A  (via drill 0.6)
  Top 0.254: v17.27,9.4 17.27,7.11 18.03,6.35 19.18,6.35 24.13,1.4 v35.31,1.4 | v15.49,14.61 15.49,16.64 12.83,19.3 12.83,21.59 12.32,22.1 12.32,28.96 12.06,29.21 12.06,29.72 v11.68,30.1
  Bottom 0.254: 37.38,1.65 R11.1 v35.31,1.4 | v17.27,9.4 17.27,12.83 v15.49,14.61 | IC1.27 10.31,29.62 10.79,30.1 v11.68,30.1 11.56,29.97
  Bottom 0.305: C16.1 37.55,1.48 R11.1
ROT4_B  (via drill 0.6)
  Top 0.254: v49.15,4.57 45.09,8.64 v44.96,8.64
  Bottom 0.254: v44.96,8.64 38.86,14.73 38.86,19.56 37.59,20.83 15.62,20.83 11.46,24.99 IC1.22 | v49.15,4.57 50.25,3.47 C17.1 50.13,3.17 R12.1
ROT4_SW
  Bottom 0.254: ROT4.S2 41,21.34 15.75,21.34 11.96,25.13 IC1.21
RST  (via drill 0.6)
  Top 0.254: v7.87,44.45 9.65,42.67 9.65,40.13 11.56,38.23 11.56,34.67 12.57,33.66 v13.59,33.66
  Bottom 0.254: v7.87,44.45 7.11,45.21 7.11,48.51 TC1.10 | IC1.7 16.12,31.12 v13.59,33.66
SPI1_CLK  (via drill 0.6)
  Top 0.254: LCD2.CLK 21.84,33.02 20.19,31.37 15.62,31.37 14.99,30.73 v14.99,30.35
  Bottom 0.254: IC1.15 14.96,30.32 v14.99,30.35 | LCD1.CLK 55.67,32.38 46.99,32.38 46.34,31.74 IC2.2 28.12,31.74 LCD2.CLK
SPI1_MISO  (via drill 0.6)
  Top 0.254: v48.9,24.26 49.02,24.26 51.05,26.29 v51.05,28.96 | v16.64,24.38 24.51,24.38 v24.64,24.51
  Bottom 0.254: v51.05,28.96 51.05,30.45 IC2.8 | v24.64,24.51 48.64,24.51 v48.9,24.26 | IC1.16 14.46,25.8 15.88,24.38 v16.64,24.38
SPI1_MOSI  (via drill 0.6)
  Top 0.254: LCD2.MOSI 25.82,29.46 14.86,29.46 v14.1,28.7
  Bottom 0.254: LCD2.MOSI IC2.1 48.51,30.48 49.15,31.11 55.67,31.11 LCD1.MOSI | IC1.17 13.96,28.56 v14.1,28.7
SWCLK
  Bottom 0.254: IC1.37 10.46,37.8 9.91,38.35 7.37,38.35 6.1,39.62 6.1,42.55 5.33,43.31 5.33,46.48 TC1.4
SWDIO
  Bottom 0.254: TC1.2 4.32,46.48 4.83,45.97 4.83,43.05 5.59,42.29 5.59,36.83 6.99,35.43 6.99,34.04 7.9,33.12 IC1.34
USB_DM
  Bottom 0.254: IC1.32 7.5,32.12 5.97,33.66 5.97,35.18 1.52,39.62 1.52,40.04 R23.2
USB_DP
  Bottom 0.254: IC1.33 7.77,32.62 6.48,33.91 6.48,35.31 2.41,39.37 2.41,40.17 R24.2

### Text on the board
tPlace: GND | ab-berry | ver 2.1 - 2017 | Designed by | Eran Rundstein
bPlace: GND | GND | H | H | L | L | +V | +V